# Altium schematic sheet LDO.SchDoc
size 381 x 241 mm; SheetNumber: 2; SheetTotal: 2
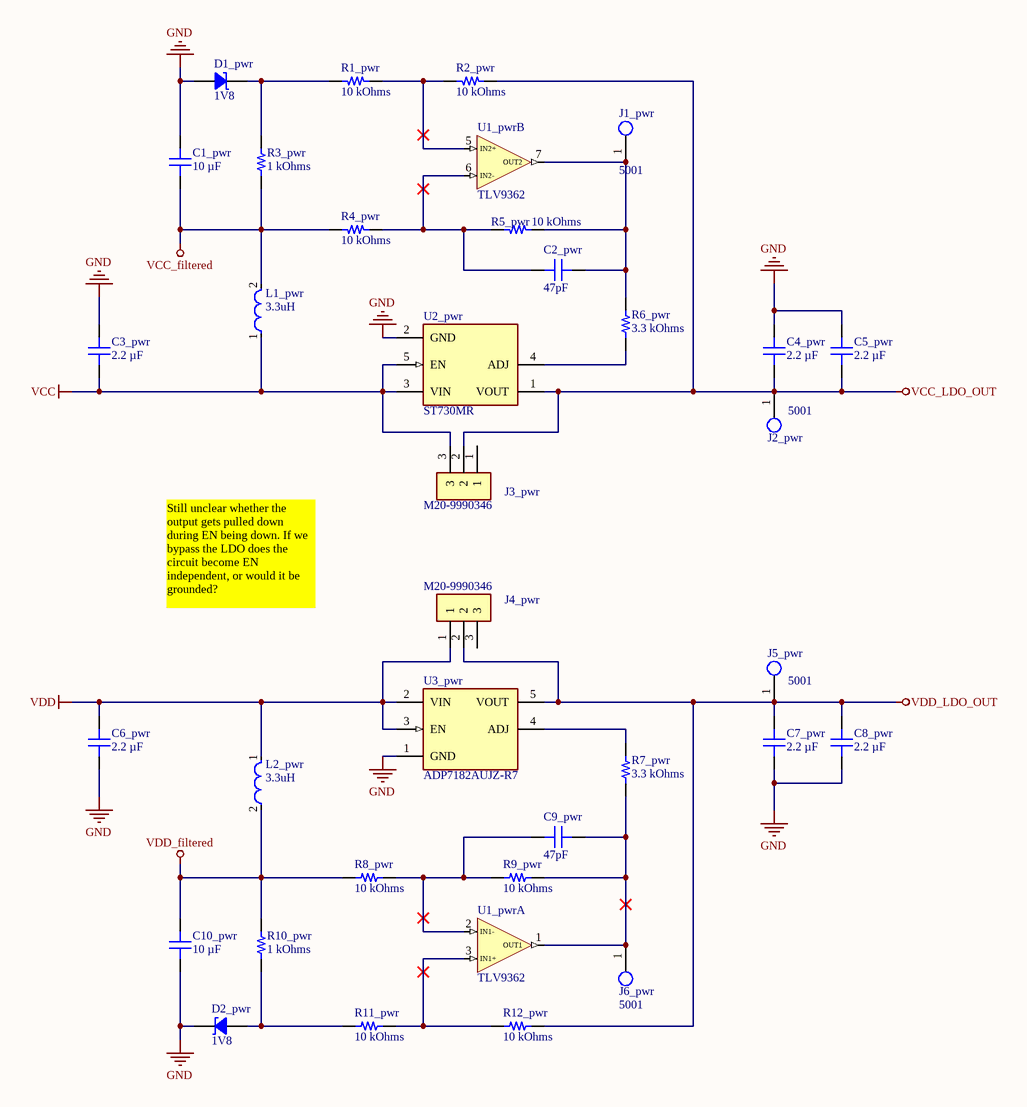
[diagram p0: LDO.SchDoc]

## Parts
C1_pwr  10 µF  [CAP 1206_3216 - 0.8MM]
C2_pwr  47pF  [CAP 1206_3216 - 1.8MM]
C3_pwr  2.2 µF  [CAP 1206_3216 - 0.8MM]
C4_pwr  2.2 µF  [CAP 1206_3216 - 0.8MM]
C5_pwr  2.2 µF  [CAP 1206_3216 - 0.8MM]
C6_pwr  2.2 µF  [CAP 1206_3216 - 0.8MM]
C7_pwr  2.2 µF  [CAP 1206_3216 - 0.8MM]
C8_pwr  2.2 µF  [CAP 1206_3216 - 0.8MM]
C9_pwr  47pF  [CAP 1206_3216 - 1.8MM]
C10_pwr  10 µF  [CAP 1206_3216 - 0.8MM]
D1_pwr  1V8  [SOD323]
D2_pwr  1V8  [SOD323]
J1_pwr  5001  [FP-5001-MFG]
J2_pwr  5001  [FP-5001-MFG]
J3_pwr  M20-9990346  [HDRV3W64P0X254_1X3_762X254X864P - duplicate]
J4_pwr  M20-9990346  [HDRV3W64P0X254_1X3_762X254X864P - duplicate]
J5_pwr  5001  [FP-5001-MFG]
J6_pwr  5001  [FP-5001-MFG]
L1_pwr  3.3uH  [FP-MLZ2012-1_25-IPC_B]
L2_pwr  3.3uH  [FP-MLZ2012-1_25-IPC_B]
R1_pwr  10 kOhms  [YAGEO RES 1206_3216]
R2_pwr  10 kOhms  [YAGEO RES 1206_3216]
R3_pwr  1 kOhms  [YAGEO RES 1206_3216]
R4_pwr  10 kOhms  [YAGEO RES 1206_3216]
R5_pwr  10 kOhms  [YAGEO RES 1206_3216]
R6_pwr  3.3 kOhms  [YAGEO RES 1206_3216]
R7_pwr  3.3 kOhms  [YAGEO RES 1206_3216]
R8_pwr  10 kOhms  [YAGEO RES 1206_3216]
R9_pwr  10 kOhms  [YAGEO RES 1206_3216]
R10_pwr  1 kOhms  [YAGEO RES 1206_3216]
R11_pwr  10 kOhms  [YAGEO RES 1206_3216]
R12_pwr  10 kOhms  [YAGEO RES 1206_3216]
U1_pwr  TLV9362  [SOIC8-127P600X175-8N]  (parts A,B of 3)
U2_pwr  ST730MR  [FP-UJ-5-IPC_B]
U3_pwr  ADP7182AUJZ-R7  [FP-UJ-5-IPC_B]

## Nets
GND: C1_pwr.1 C3_pwr.1 C4_pwr.1 C5_pwr.1 C6_pwr.1 C7_pwr.1 C8_pwr.1 C10_pwr.1 D1_pwr.1 D2_pwr.2 U2_pwr.2(GND) U3_pwr.1(GND)
VCC: C3_pwr.2 J3_pwr.3 L1_pwr.1 U2_pwr.3(VIN) U2_pwr.5(EN)
VCC_filtered: C1_pwr.2 L1_pwr.2 R3_pwr.1 R4_pwr.2
VCC_LDO_OUT: C4_pwr.2 C5_pwr.2 J2_pwr.1 J3_pwr.2 R2_pwr.1 U2_pwr.1(VOUT)
VDD: C6_pwr.2 J4_pwr.1 L2_pwr.1 U3_pwr.2(VIN) U3_pwr.3(EN)
VDD_filtered: C10_pwr.2 L2_pwr.2 R8_pwr.2 R10_pwr.2
VDD_LDO_OUT: C7_pwr.2 C8_pwr.2 J4_pwr.2 J5_pwr.1 R12_pwr.1 U3_pwr.5(VOUT)
NetC2_pwr_1: C2_pwr.1 R4_pwr.1 R5_pwr.2 U1_pwr.6(IN2-)
NetC2_pwr_2: C2_pwr.2 J1_pwr.1 R5_pwr.1 R6_pwr.1 U1_pwr.7(OUT2)
NetC9_pwr_1: C9_pwr.1 R8_pwr.1 R9_pwr.2 U1_pwr.2(IN1-)
NetC9_pwr_2: C9_pwr.2 J6_pwr.1 R7_pwr.2 R9_pwr.1 U1_pwr.1(OUT1)
NetD1_pwr_2: D1_pwr.2 R1_pwr.2 R3_pwr.2
NetD2_pwr_1: D2_pwr.1 R10_pwr.1 R11_pwr.2
NetR1_pwr_1: R1_pwr.1 R2_pwr.2 U1_pwr.5(IN2+)
NetR6_pwr_2: R6_pwr.2 U2_pwr.4(ADJ)
NetR7_pwr_1: R7_pwr.1 U3_pwr.4(ADJ)
NetR11_pwr_1: R11_pwr.1 R12_pwr.2 U1_pwr.3(IN1+)

Not connected (* = marked no-connect by the designer): J3_pwr 1; J4_pwr 3

## Notes on the sheet
- Still unclear whether the output gets pulled down during EN being down. If we bypass the LDO does the circuit become EN independent, or would it be grounded?
- Type @ to refer to a designator or a net

## Library data of the parts
C1_pwr C10_pwr = 885012208069: CAP CER 10UF 25V X7R 1206; manufacturer: Würth Elektronik; Tolerance: ±10%; Part Number: 885012208069; Capacitance: 10 µF; Applications: General Purpose; componentlink1description: Datasheet; componentlink1url: https://katalog.we-online.de/pbs/datasheet/885012208069.pdf; componentlink2description: DigiKey Link; componentlink2url: https://www.digikey.com/en/products/detail/würth-elektronik/885012208069/5453429; Device Package: 1206 (3216 Metric); lastupdated: 6/4/2024 19:10:32; Lifecycle Status: Active; Minimum Order: 1; Mounting Type: Surface Mount, MLCC; Operating Temperature: -55°C ~ 125°C; Package / Case: 1206 (3216 Metric); packaging: TapeAndReel; partid: 43199; Part Status: Active; price: 0.40; series: WCAP-CSGP; Size / Dimension: 0.126" L x 0.063" W (3.20mm x 1.60mm); Supplier 1: DigiKey; Supplier Part Number 1: 732-7574-1-ND; Temperature Coefficient: X7R; Thickness (Max): 0.075" (1.90mm); value: 10 µF; Voltage - Rated: 25V
C2_pwr C9_pwr = 1206AA470KAT1A: CAP CER 47PF 1KV C0G/NP0 1206; manufacturer: AVX Corporation; Temperature Coefficient: C0G, NP0; Tolerance: ±10%; Voltage - Rated: 1000V (1kV); Part Number: 1206AA470KAT1A; Capacitance: 47pF; Applications: General Purpose; componentlink1description: Datasheet; componentlink1url: http://datasheets.avx.com/AVX-HV_MLCC.pdf; componentlink2description: DigiKey Link; componentlink2url: http://digikey.com/product-detail/en/avx-corporation/1206AA470KAT1A/478-2949-1-ND/808148; Device Package: 1206 (3216 Metric); Features: High Voltage; lastupdated: 9/2/2020 01:05:31; Lifecycle Status: Active; Minimum Order: 1; Mounting Type: Surface Mount, MLCC; Operating Temperature: -55°C ~ 125°C; Package / Case: 1206 (3216 Metric); packaging: TapeAndReel; partid: 21825; Part Status: Active; price: 0.11; series: -; Size / Dimension: 0.130" L x 0.063" W (3.30mm x 1.60mm); Supplier 1: DigiKey; Supplier Part Number 1: 478-2949-1-ND; Thickness (Max): 0.071" (1.80mm); value: 47pF
C3_pwr C4_pwr C5_pwr C6_pwr C7_pwr C8_pwr = 885382208001: CAP CER 2.2UF 25V X7R 1206; manufacturer: Würth Elektronik; Tolerance: ±10%; Part Number: 885382208001; Capacitance: 2.2 µF; Applications: Boardflex Sensitive; componentlink2description: DigiKey Link; componentlink2url: https://www.digikey.com/en/products/detail/würth-elektronik/885382208001/9816354; Device Package: 1206 (3216 Metric); Features: Soft Termination; lastupdated: 6/4/2024 19:10:38; Lifecycle Status: Active; Minimum Order: 1; Mounting Type: Surface Mount, MLCC; Operating Temperature: -55°C ~ 125°C; Package / Case: 1206 (3216 Metric); packaging: TapeAndReel; partid: 45904; Part Status: Active; price: 0.35; series: WCAP-CSST; Size / Dimension: 0.126" L x 0.063" W (3.20mm x 1.60mm); Supplier 1: DigiKey; Supplier Part Number 1: 732-13199-1-ND; Temperature Coefficient: X7R; Thickness (Max): 0.083" (2.10mm); value: 2.2 µF; Voltage - Rated: 25V
D1_pwr D2_pwr = BZX38450-C1V8X
J1_pwr J2_pwr J5_pwr J6_pwr = CMP-2000-05181-2: PC TEST POINT MINIATURE BLACK; Body Material: Bronze; Plating: Silver; Inside Diameter: 1.27mm; Hole Diameter: 1.6mm; Number of Ports: 1; Outside Diameter: 2.54mm; Insulation: Insulated; Insulation Material: Nylon; Mount: Through Hole; RoHS Compliant: Yes; Series: THM; Height: 0.3inch; Termination: Through Hole; Material: Nylon; Packaging: Bulk; Contact Material: Bronze; REACH SVHC: No SVHC; Contact Plating: Silver; Orientation: Straight; Lead Free: Lead Free; Package Quantity: 100; Length: 7.62mm; Flammability Rating: UL94 V-0; Number of Contacts: 1; Diameter: 2.54mm; Housing Color: Black; Color: Black
J3_pwr J4_pwr = M20-9990346: Connector; Manufacturer_Name: Harwin; Datasheet Link: https://cdn.harwin.com/pdfs/M20-999.pdf; Height: 8.64mm; Manufacturer_Part_Number: M20-9990346; Mouser Part Number: 855-M20-9990346; Mouser Price/Stock: https://www.mouser.co.uk/ProductDetail/Harwin/M20-9990346?qs=ulE8k0yEMYbyhQ3uXpFs8Q%3D%3D
L1_pwr L2_pwr = MLZ2012M: Shielded Multilayer Inductor 3.3uH ±20% 500mA 260mΩ SMD 0805; Saturation Current: 350mA; Core Material: Ferrite; DC Resistance (DCR): 260mR; RoHS Compliant: Yes; Mount: Surface Mount; Case Code (Metric): 2012; Case/Package: 0805; Min Operating Temperature: -55°C; Package Quantity: 2000; Shielding: Shielded; Current Rating: 500mA; Height - Seated (Max): 0.057inch; Case Code (Imperial): 0805; Width: 0.049inch; Tolerance: 20%; Packaging: Tape and Reel; Inductance: 3.3uH; Lead Free: Lead Free; Max Operating Temperature: 125°C; Length: 0.079inch; Value: 3.3uH
R1_pwr R2_pwr R4_pwr R5_pwr R8_pwr R9_pwr R11_pwr R12_pwr = RT1206FRE0710KL: RES SMD 10K OHM 1% 1/4W 1206; Manufacturer: Yageo; Power (Watts): 0.25W, 1/4W; Temperature Coefficient: ±50ppm/°C; Part Number: RT1206FRE0710KL; ComponentLink1Description: Datasheet; ComponentLink1URL: https://www.yageo.com/upload/media/product/productsearch/datasheet/rchip/PYu-RT_1-to-0.01_RoHS_L_11.pdf; ComponentLink2Description: DigiKey Link; ComponentLink2URL: https://www.digikey.com/en/products/detail/yageo/RT1206FRE0710KL/1082868; Composition: Thin Film; Device Package: 1206 (3216 Metric); Height - Seated (Max): 0.026" (0.65mm); LastUpdated: 7/25/2024 09:21:28; Lifecycle Status: Active; Minimum Order: 1; Number of Terminations: 2; Operating Temperature: -55°C ~ 155°C; Package / Case: 1206 (3216 Metric); Packaging: TapeAndReel; PartId: 38903; Part Status: Active; Price: 0.01; Resistance: 10 kOhms; Series: RT; Size / Dimension: 0.122" L x 0.063" W (3.10mm x 1.60mm); Supplier 1: DigiKey; Supplier Part Number 1: YAG1242CT-ND; Supplier Device Package: 1206; Tolerance: ±1%; Value: 10 kOhms
R3_pwr R10_pwr = RT1206FRE071KL: RES SMD 1K OHM 1% 1/4W 1206; Manufacturer: Yageo; Power (Watts): 0.25W, 1/4W; Temperature Coefficient: ±50ppm/°C; Part Number: RT1206FRE071KL; ComponentLink1Description: Datasheet; ComponentLink1URL: https://www.yageo.com/upload/media/product/productsearch/datasheet/rchip/PYu-RT_1-to-0.01_RoHS_L_11.pdf; ComponentLink2Description: DigiKey Link; ComponentLink2URL: https://www.digikey.com/en/products/detail/yageo/RT1206FRE071KL/1083016; Composition: Thin Film; Device Package: 1206 (3216 Metric); Height - Seated (Max): 0.026" (0.65mm); LastUpdated: 7/25/2024 09:21:27; Lifecycle Status: Active; Minimum Order: 1; Number of Terminations: 2; Operating Temperature: -55°C ~ 155°C; Package / Case: 1206 (3216 Metric); Packaging: TapeAndReel; PartId: 40465; Part Status: Active; Price: 0.01; Resistance: 1 kOhms; Series: RT; Size / Dimension: 0.122" L x 0.063" W (3.10mm x 1.60mm); Supplier 1: DigiKey; Supplier Part Number 1: YAG3366CT-ND; Supplier Device Package: 1206; Tolerance: ±1%; Value: 1 kOhms
R6_pwr R7_pwr = RT1206FRE073K3L: RES SMD 3.3K OHM 1% 1/4W 1206; Manufacturer: Yageo; Power (Watts): 0.25W, 1/4W; Temperature Coefficient: ±50ppm/°C; Part Number: RT1206FRE073K3L; ComponentLink1Description: Datasheet; ComponentLink1URL: https://www.yageo.com/upload/media/product/productsearch/datasheet/rchip/PYu-RT_1-to-0.01_RoHS_L_12.pdf; ComponentLink2Description: DigiKey Link; ComponentLink2URL: https://www.digikey.com/en/products/detail/yageo/RT1206FRE073K3L/1083187; Composition: Thin Film; Device Package: 1206 (3216 Metric); Height - Seated (Max): 0.026" (0.65mm); LastUpdated: 7/25/2024 09:21:22; Lifecycle Status: Active; Minimum Order: 1; Number of Terminations: 2; Operating Temperature: -55°C ~ 155°C; Package / Case: 1206 (3216 Metric); Packaging: TapeAndReel; PartId: 58380; Price: 0.01; Resistance: 3.3 kOhms; Series: RT; Size / Dimension: 0.122" L x 0.063" W (3.10mm x 1.60mm); Supplier 1: DigiKey; Supplier Part Number 1: 13-RT1206FRE073K3LCT-ND; Supplier Device Package: 1206; Tolerance: ±1%; Value: 3.3 kOhms; Part Status: Active
U1_pwr = TLV9362: TLV936x 10-MHz, 40-V, RRO, Operational Amplifie; ComponentLink1Description: Datasheet; ComponentLink1URL: https://www.ti.com/lit/ds/symlink/tlv9362.pdf
U3_pwr = ADP7182: IC REG LIN NEG ADJ 200MA 5TSOT; Manufacturer: Analog Devices; Number Of Outputs: 1; Min Supply Voltage: -2.7V; Max Junction Temp: +125°C; Dropout Voltage: -185mV; Output Current: -200mA; Max Supply Voltage: -28V; Output Voltage: -1.22/-27.815V; Nominal Supply Current: -33/-650uA; Output Type: AdjustableProgrammable; Accuracy Percentage: 1%; RoHS: TRUE; Ambient Temperature Range Low: -40°C; Digikey Description: IC REG LIN NEG ADJ 200MA 5TSOT; Device Class L3: Voltage Regulators - Linear; Ambient Temperature Range High: +85°C; Manufacturer Part Number: ADP7182AUJZ-R7; ComponentLink2URL: https://www.analog.com/media/en/technical-documentation/data-sheets/ADP7182.pdf; Ipc Land Pattern Name: SOT95P280X100-5; Temperature Range Low: -40°C; ComponentLink2Description: Datasheet; Mouser Description: LDO Regulator Neg -1.22V to -27V 0.2A 5-Pin TSOT T/R; Category: IC; Automotive: No; Device Class L1: Integrated Circuits (ICs); Temperature: -40°C to +125°C; Octopart: https://octopart.com/adp7182aujz-r7-analog+devices-21054665; Device Class L2: Power Management ICs; Height: 1mm; Package: UJ-5; Temperature Range High: +125°C; Lead Free: Yes